# Altium schematic sheet SCH-CAPE-Nucleo_Interface_V1R0.SchDoc: Cajun Advanced Picosatellite Experiment - CAPE-3 - AX5043 Nucleo Interface Board - V1R0
size D; Date: 09/05/2019; CompanyName: Cajun Advanced Picosatellite Experiment; DrawnBy: Nolan Edwards; Organization: Nolan Edwards; Address1: 337 852 0914; Address2: nje@nolanjohnedwards.com; Address3: LA EI.0033436; Address4: Customer:; Revision: 0; SheetNumber: 1; SheetTotal: 1; Version: 1; Draft: DRAFT
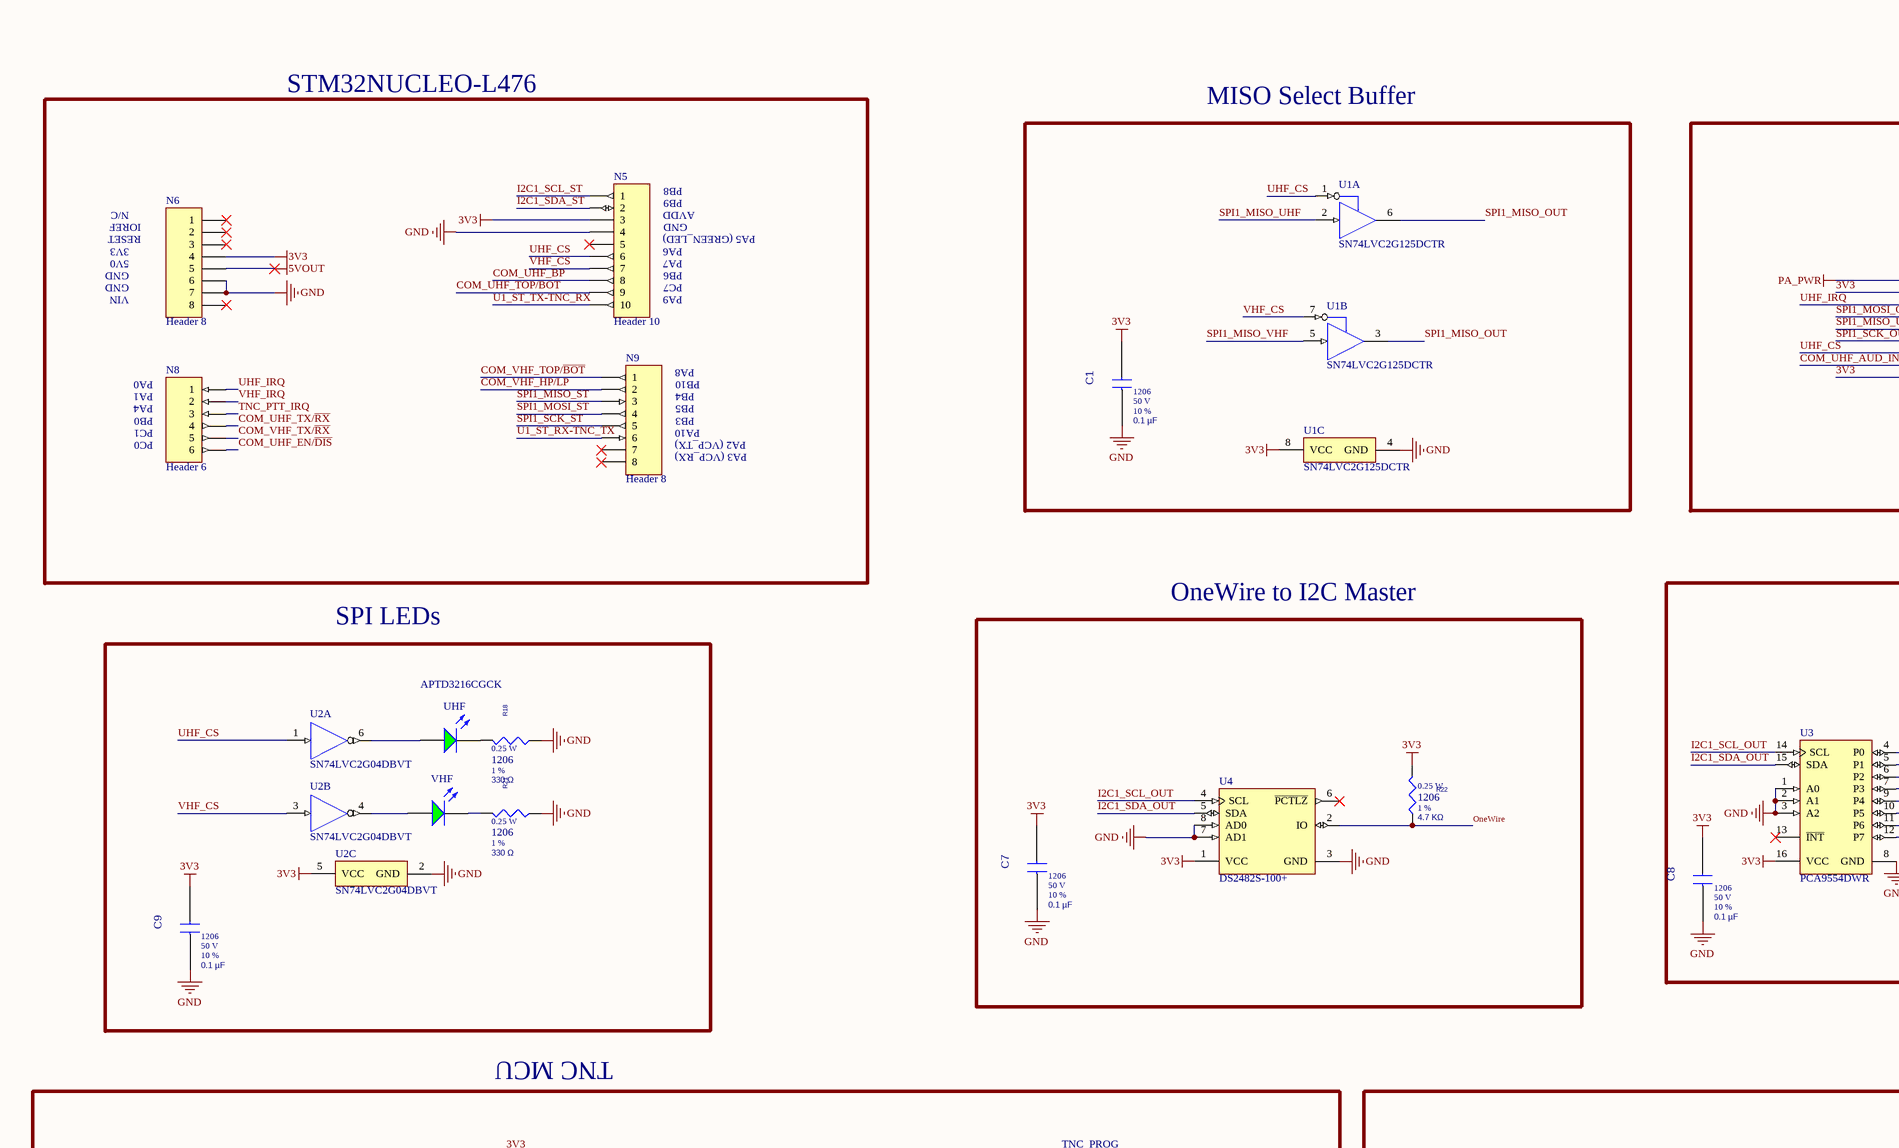
[diagram p0: SCH-CAPE-Nucleo_Interface_V1R0.SchDoc, top left]
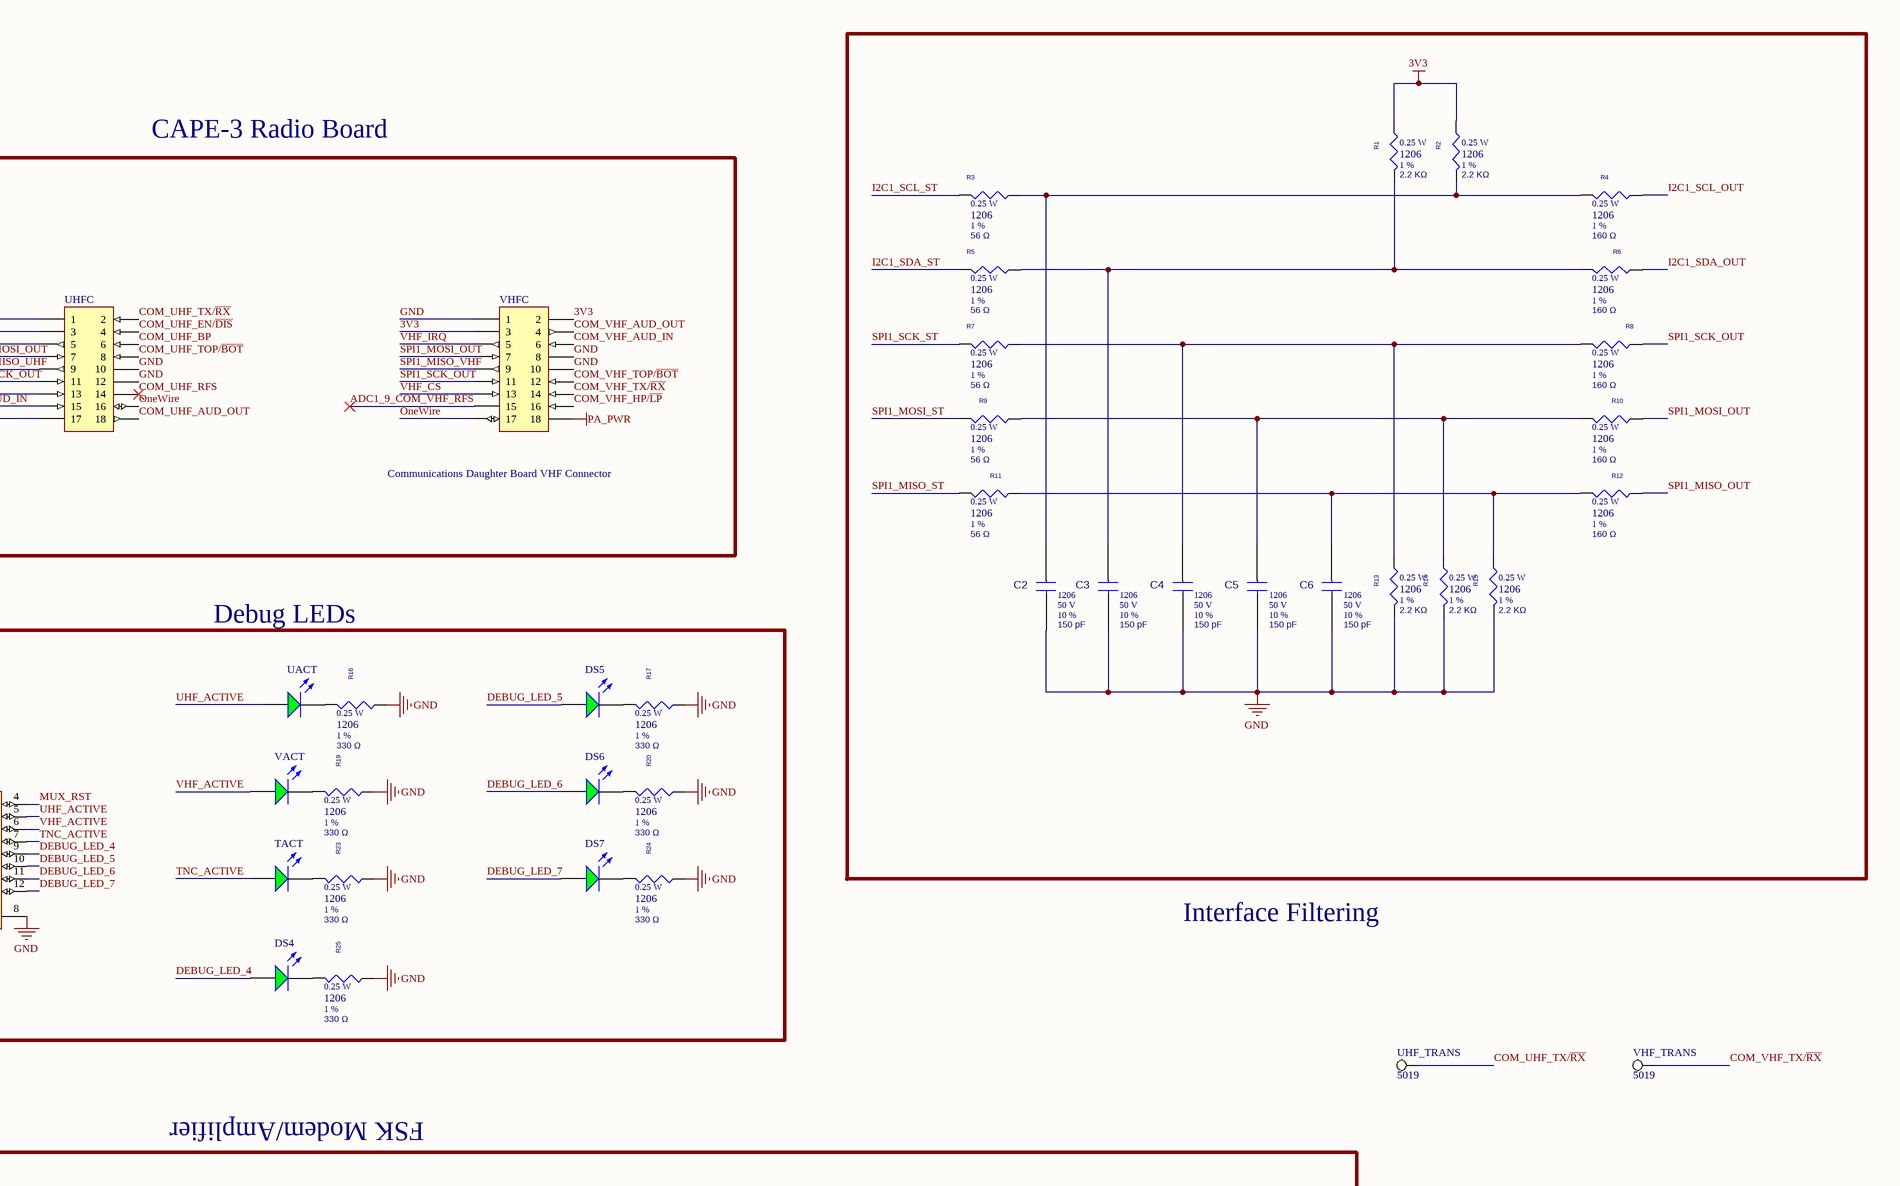
[diagram p1: SCH-CAPE-Nucleo_Interface_V1R0.SchDoc, top right]
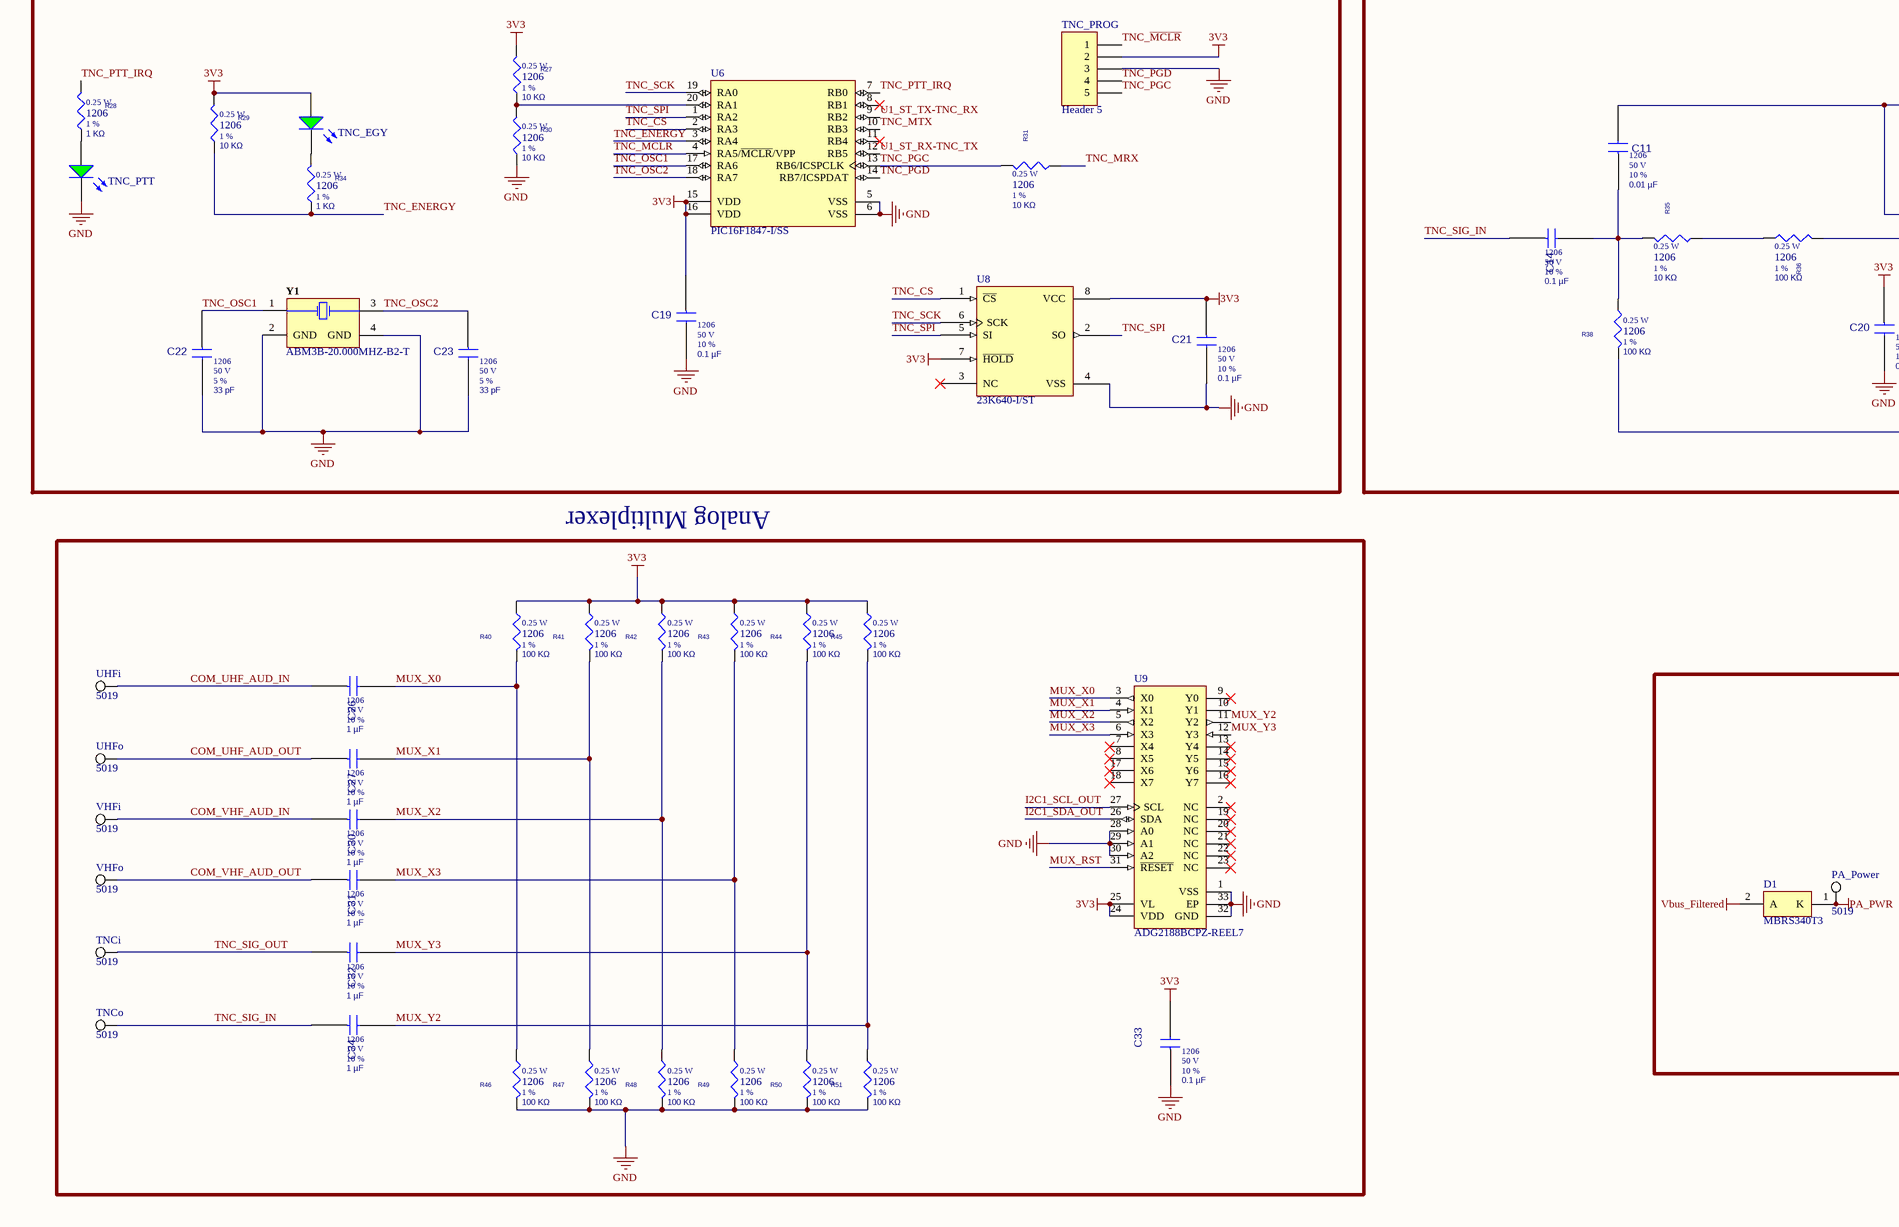
[diagram p2: SCH-CAPE-Nucleo_Interface_V1R0.SchDoc, bottom left]
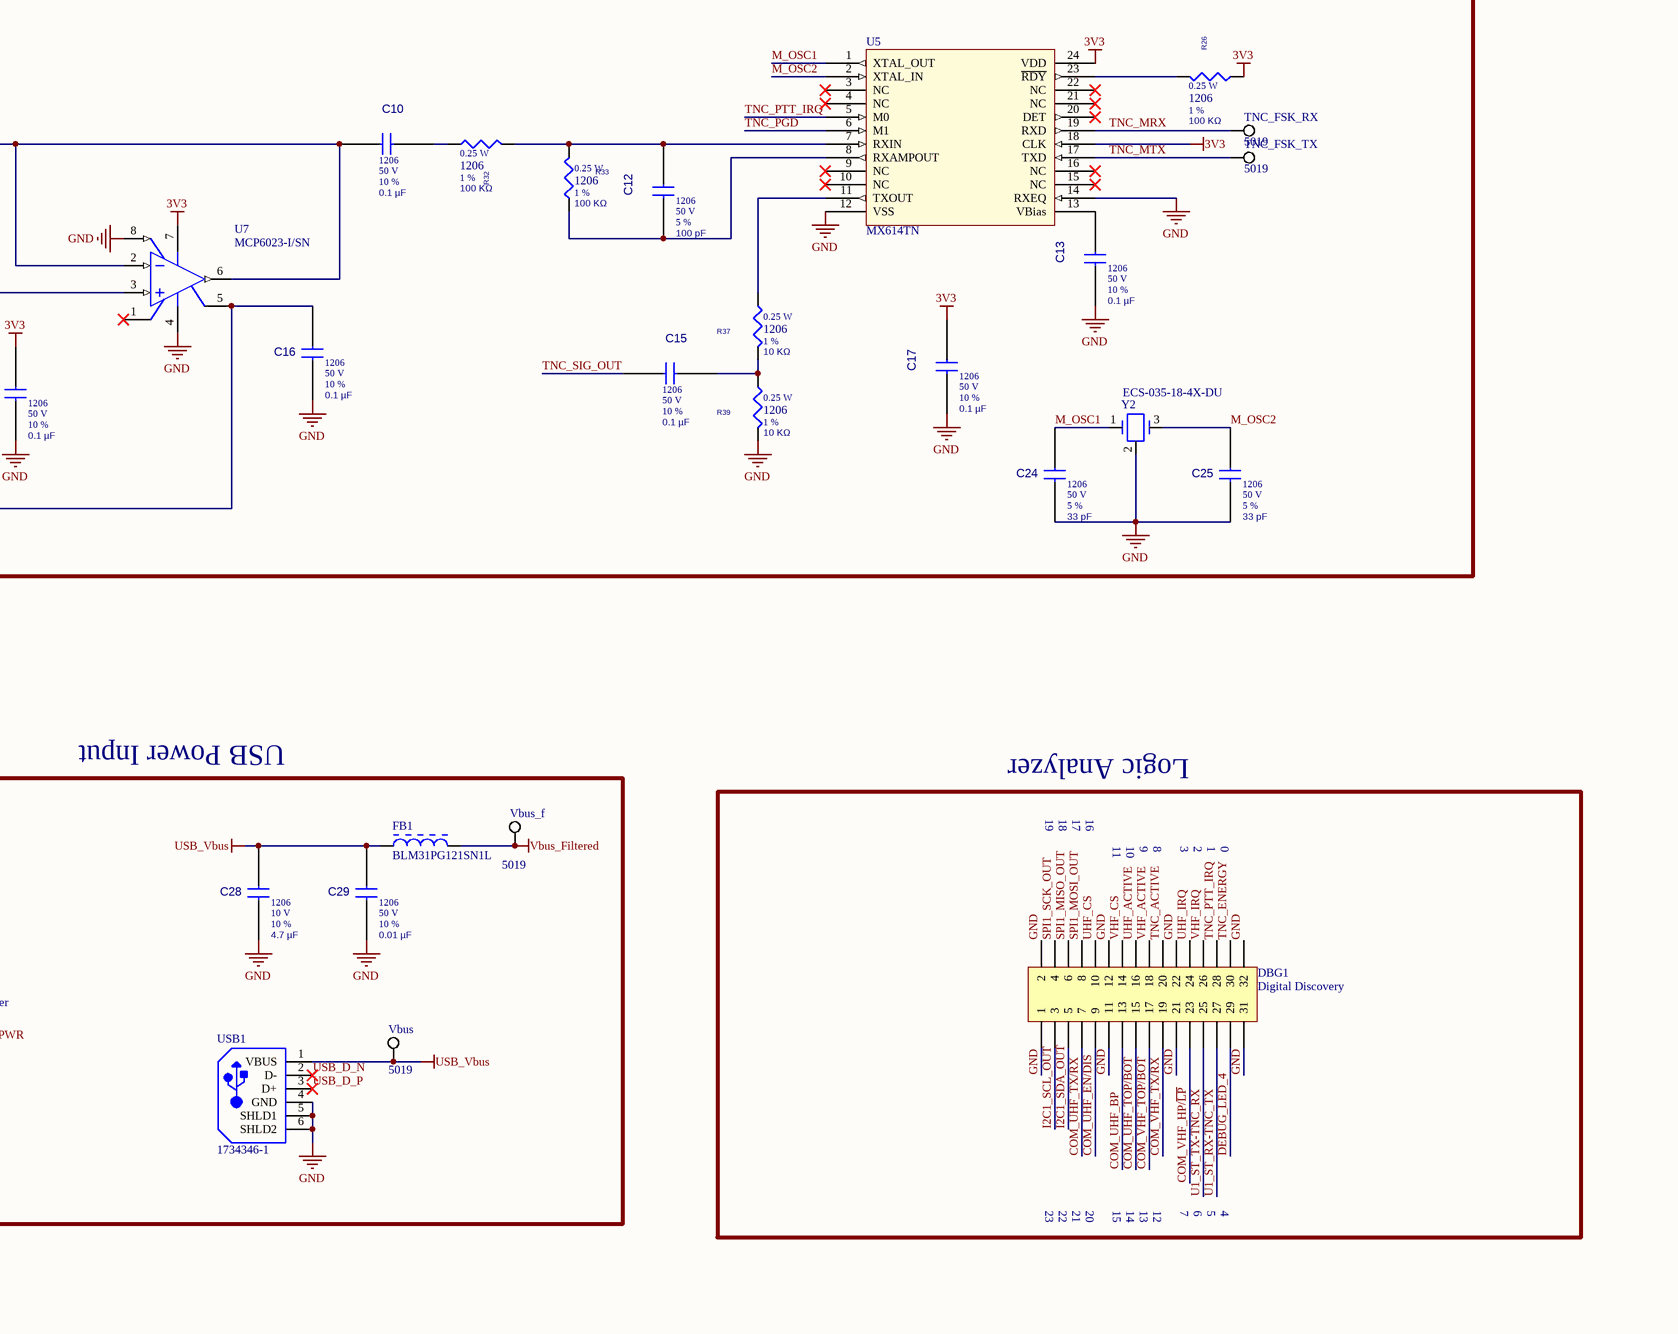
[diagram p3: SCH-CAPE-Nucleo_Interface_V1R0.SchDoc, bottom right]

## Parts
C1  value 0.1 µF  Package: 1206  Voltage Rating: 50 V  Tolerance: 10 %  [1206_GENERIC]  (hidden comment: SMT Capacitor)
C2  value 150 pF  Package: 1206  Voltage Rating: 50 V  Tolerance: 10 %  [1206_GENERIC]  (hidden comment: SMT Capacitor)
C3  value 150 pF  Package: 1206  Voltage Rating: 50 V  Tolerance: 10 %  [1206_GENERIC]  (hidden comment: SMT Capacitor)
C4  value 150 pF  Package: 1206  Voltage Rating: 50 V  Tolerance: 10 %  [1206_GENERIC]  (hidden comment: SMT Capacitor)
C5  value 150 pF  Package: 1206  Voltage Rating: 50 V  Tolerance: 10 %  [1206_GENERIC]  (hidden comment: SMT Capacitor)
C6  value 150 pF  Package: 1206  Voltage Rating: 50 V  Tolerance: 10 %  [1206_GENERIC]  (hidden comment: SMT Capacitor)
C7  value 0.1 µF  Package: 1206  Voltage Rating: 50 V  Tolerance: 10 %  [1206_GENERIC]  (hidden comment: SMT Capacitor)
C8  value 0.1 µF  Package: 1206  Voltage Rating: 50 V  Tolerance: 10 %  [1206_GENERIC]  (hidden comment: SMT Capacitor)
C9  value 0.1 µF  Package: 1206  Voltage Rating: 50 V  Tolerance: 10 %  [1206_GENERIC]  (hidden comment: SMT Capacitor)
C10  value 0.1 µF  Package: 1206  Voltage Rating: 50 V  Tolerance: 10 %  [1206_GENERIC]  (hidden comment: SMT Capacitor)
C11  value 0.01 µF  Package: 1206  Voltage Rating: 50 V  Tolerance: 10 %  [1206_GENERIC]  (hidden comment: SMT Capacitor)
C12  value 100 pF  Package: 1206  Voltage Rating: 50 V  Tolerance: 5 %  [1206_GENERIC]  (hidden comment: SMT Capacitor)
C13  value 0.1 µF  Package: 1206  Voltage Rating: 50 V  Tolerance: 10 %  [1206_GENERIC]  (hidden comment: SMT Capacitor)
C14  value 0.1 µF  Package: 1206  Voltage Rating: 50 V  Tolerance: 10 %  [1206_GENERIC]  (hidden comment: SMT Capacitor)
C15  value 0.1 µF  Package: 1206  Voltage Rating: 50 V  Tolerance: 10 %  [1206_GENERIC]  (hidden comment: SMT Capacitor)
C16  value 0.1 µF  Package: 1206  Voltage Rating: 50 V  Tolerance: 10 %  [1206_GENERIC]  (hidden comment: SMT Capacitor)
C17  value 0.1 µF  Package: 1206  Voltage Rating: 50 V  Tolerance: 10 %  [1206_GENERIC]  (hidden comment: SMT Capacitor)
C19  value 0.1 µF  Package: 1206  Voltage Rating: 50 V  Tolerance: 10 %  [1206_GENERIC]  (hidden comment: SMT Capacitor)
C20  value 0.1 µF  Package: 1206  Voltage Rating: 50 V  Tolerance: 10 %  [1206_GENERIC]  (hidden comment: SMT Capacitor)
C21  value 0.1 µF  Package: 1206  Voltage Rating: 50 V  Tolerance: 10 %  [1206_GENERIC]  (hidden comment: SMT Capacitor)
C22  value 33 pF  Package: 1206  Voltage Rating: 50 V  Tolerance: 5 %  [1206_GENERIC]  (hidden comment: SMT Capacitor)
C23  value 33 pF  Package: 1206  Voltage Rating: 50 V  Tolerance: 5 %  [1206_GENERIC]  (hidden comment: SMT Capacitor)
C24  value 33 pF  Package: 1206  Voltage Rating: 50 V  Tolerance: 5 %  [1206_GENERIC]  (hidden comment: SMT Capacitor)
C25  value 33 pF  Package: 1206  Voltage Rating: 50 V  Tolerance: 5 %  [1206_GENERIC]  (hidden comment: SMT Capacitor)
C26  value 1 µF  Package: 1206  Voltage Rating: 16 V  Tolerance: 10 %  [1206_GENERIC]  (hidden comment: SMT Capacitor)
C27  value 1 µF  Package: 1206  Voltage Rating: 16 V  Tolerance: 10 %  [1206_GENERIC]  (hidden comment: SMT Capacitor)
C28  value 4.7 µF  Package: 1206  Voltage Rating: 10 V  Tolerance: 10 %  [1206_GENERIC]  (hidden comment: SMT Capacitor)
C29  value 0.01 µF  Package: 1206  Voltage Rating: 50 V  Tolerance: 10 %  [1206_GENERIC]  (hidden comment: SMT Capacitor)
C30  value 1 µF  Package: 1206  Voltage Rating: 16 V  Tolerance: 10 %  [1206_GENERIC]  (hidden comment: SMT Capacitor)
C31  value 1 µF  Package: 1206  Voltage Rating: 16 V  Tolerance: 10 %  [1206_GENERIC]  (hidden comment: SMT Capacitor)
C32  value 1 µF  Package: 1206  Voltage Rating: 16 V  Tolerance: 10 %  [1206_GENERIC]  (hidden comment: SMT Capacitor)
C33  value 0.1 µF  Package: 1206  Voltage Rating: 50 V  Tolerance: 10 %  [1206_GENERIC]  (hidden comment: SMT Capacitor)
C34  value 1 µF  Package: 1206  Voltage Rating: 16 V  Tolerance: 10 %  [1206_GENERIC]  (hidden comment: SMT Capacitor)
D1  MBRS340T3  [ONSC-SMC-2-403-03_V]
DBG1  Digital Discovery  [HDR2X16H]
DS4  APTD3216CGCK  [KING-APTD3216CGCK_V]  (value not drawn)
DS5  APTD3216CGCK  [KING-APTD3216CGCK_V]  (value not drawn)
DS6  APTD3216CGCK  [KING-APTD3216CGCK_V]  (value not drawn)
DS7  APTD3216CGCK  [KING-APTD3216CGCK_V]  (value not drawn)
FB1  BLM31PG121SN1L  [MURA-BLM31-B35-CHIP-2_V2]
N5  Header 10  [HDR1X10]  (no BOM)
N6  Header 8  [HDR1X8]  (no BOM)
N8  Header 6  [HDR1X6]  (no BOM)
N9  Header 8  [HDR1X8]  (no BOM)
PA_Power  5019  [KSTN-5019_V]
R1  value 2.2 KΩ  Power Rating: 0.25 W  Package: 1206  Tolerance: 1 %  [1206_GENERIC]  (hidden comment: SMT Resistor)
R2  value 2.2 KΩ  Power Rating: 0.25 W  Package: 1206  Tolerance: 1 %  [1206_GENERIC]  (hidden comment: SMT Resistor)
R3  value 56 Ω  Power Rating: 0.25 W  Package: 1206  Tolerance: 1 %  [1206_GENERIC]  (hidden comment: SMT Resistor)
R4  value 160 Ω  Power Rating: 0.25 W  Package: 1206  Tolerance: 1 %  [1206_GENERIC]  (hidden comment: SMT Resistor)
R5  value 56 Ω  Power Rating: 0.25 W  Package: 1206  Tolerance: 1 %  [1206_GENERIC]  (hidden comment: SMT Resistor)
R6  value 160 Ω  Power Rating: 0.25 W  Package: 1206  Tolerance: 1 %  [1206_GENERIC]  (hidden comment: SMT Resistor)
R7  value 56 Ω  Power Rating: 0.25 W  Package: 1206  Tolerance: 1 %  [1206_GENERIC]  (hidden comment: SMT Resistor)
R8  value 160 Ω  Power Rating: 0.25 W  Package: 1206  Tolerance: 1 %  [1206_GENERIC]  (hidden comment: SMT Resistor)
R9  value 56 Ω  Power Rating: 0.25 W  Package: 1206  Tolerance: 1 %  [1206_GENERIC]  (hidden comment: SMT Resistor)
R10  value 160 Ω  Power Rating: 0.25 W  Package: 1206  Tolerance: 1 %  [1206_GENERIC]  (hidden comment: SMT Resistor)
R11  value 56 Ω  Power Rating: 0.25 W  Package: 1206  Tolerance: 1 %  [1206_GENERIC]  (hidden comment: SMT Resistor)
R12  value 160 Ω  Power Rating: 0.25 W  Package: 1206  Tolerance: 1 %  [1206_GENERIC]  (hidden comment: SMT Resistor)
R13  value 2.2 KΩ  Power Rating: 0.25 W  Package: 1206  Tolerance: 1 %  [1206_GENERIC]  (hidden comment: SMT Resistor)
R14  value 2.2 KΩ  Power Rating: 0.25 W  Package: 1206  Tolerance: 1 %  [1206_GENERIC]  (hidden comment: SMT Resistor)
R15  value 2.2 KΩ  Power Rating: 0.25 W  Package: 1206  Tolerance: 1 %  [1206_GENERIC]  (hidden comment: SMT Resistor)
R16  value 330 Ω  Power Rating: 0.25 W  Package: 1206  Tolerance: 1 %  [1206_GENERIC]  (hidden comment: SMT Resistor)
R17  value 330 Ω  Power Rating: 0.25 W  Package: 1206  Tolerance: 1 %  [1206_GENERIC]  (hidden comment: SMT Resistor)
R18  value 330 Ω  Power Rating: 0.25 W  Package: 1206  Tolerance: 1 %  [1206_GENERIC]  (hidden comment: SMT Resistor)
R19  value 330 Ω  Power Rating: 0.25 W  Package: 1206  Tolerance: 1 %  [1206_GENERIC]  (hidden comment: SMT Resistor)
R20  value 330 Ω  Power Rating: 0.25 W  Package: 1206  Tolerance: 1 %  [1206_GENERIC]  (hidden comment: SMT Resistor)
R21  value 330 Ω  Power Rating: 0.25 W  Package: 1206  Tolerance: 1 %  [1206_GENERIC]  (hidden comment: SMT Resistor)
R22  value 4.7 KΩ  Power Rating: 0.25 W  Package: 1206  Tolerance: 1 %  [1206_GENERIC]  (hidden comment: SMT Resistor)
R23  value 330 Ω  Power Rating: 0.25 W  Package: 1206  Tolerance: 1 %  [1206_GENERIC]  (hidden comment: SMT Resistor)
R24  value 330 Ω  Power Rating: 0.25 W  Package: 1206  Tolerance: 1 %  [1206_GENERIC]  (hidden comment: SMT Resistor)
R25  value 330 Ω  Power Rating: 0.25 W  Package: 1206  Tolerance: 1 %  [1206_GENERIC]  (hidden comment: SMT Resistor)
R26  value 100 KΩ  Power Rating: 0.25 W  Package: 1206  Tolerance: 1 %  [1206_GENERIC]  (hidden comment: SMT Resistor)
R27  value 10 KΩ  Power Rating: 0.25 W  Package: 1206  Tolerance: 1 %  [1206_GENERIC]  (hidden comment: SMT Resistor)
R28  value 1 KΩ  Power Rating: 0.25 W  Package: 1206  Tolerance: 1 %  [1206_GENERIC]  (hidden comment: SMT Resistor)
R29  value 10 KΩ  Power Rating: 0.25 W  Package: 1206  Tolerance: 1 %  [1206_GENERIC]  (hidden comment: SMT Resistor)
R30  value 10 KΩ  Power Rating: 0.25 W  Package: 1206  Tolerance: 1 %  [1206_GENERIC]  (hidden comment: SMT Resistor)
R31  value 10 KΩ  Power Rating: 0.25 W  Package: 1206  Tolerance: 1 %  [1206_GENERIC]  (hidden comment: SMT Resistor)
R32  value 100 KΩ  Power Rating: 0.25 W  Package: 1206  Tolerance: 1 %  [1206_GENERIC]  (hidden comment: SMT Resistor)
R33  value 100 KΩ  Power Rating: 0.25 W  Package: 1206  Tolerance: 1 %  [1206_GENERIC]  (hidden comment: SMT Resistor)
R34  value 1 KΩ  Power Rating: 0.25 W  Package: 1206  Tolerance: 1 %  [1206_GENERIC]  (hidden comment: SMT Resistor)
R35  value 10 KΩ  Power Rating: 0.25 W  Package: 1206  Tolerance: 1 %  [1206_GENERIC]  (hidden comment: SMT Resistor)
R36  value 100 KΩ  Power Rating: 0.25 W  Package: 1206  Tolerance: 1 %  [1206_GENERIC]  (hidden comment: SMT Resistor)
R37  value 10 KΩ  Power Rating: 0.25 W  Package: 1206  Tolerance: 1 %  [1206_GENERIC]  (hidden comment: SMT Resistor)
R38  value 100 KΩ  Power Rating: 0.25 W  Package: 1206  Tolerance: 1 %  [1206_GENERIC]  (hidden comment: SMT Resistor)
R39  value 10 KΩ  Power Rating: 0.25 W  Package: 1206  Tolerance: 1 %  [1206_GENERIC]  (hidden comment: SMT Resistor)
R40  value 100 KΩ  Power Rating: 0.25 W  Package: 1206  Tolerance: 1 %  [1206_GENERIC]  (hidden comment: SMT Resistor)
R41  value 100 KΩ  Power Rating: 0.25 W  Package: 1206  Tolerance: 1 %  [1206_GENERIC]  (hidden comment: SMT Resistor)
R42  value 100 KΩ  Power Rating: 0.25 W  Package: 1206  Tolerance: 1 %  [1206_GENERIC]  (hidden comment: SMT Resistor)
R43  value 100 KΩ  Power Rating: 0.25 W  Package: 1206  Tolerance: 1 %  [1206_GENERIC]  (hidden comment: SMT Resistor)
R44  value 100 KΩ  Power Rating: 0.25 W  Package: 1206  Tolerance: 1 %  [1206_GENERIC]  (hidden comment: SMT Resistor)
R45  value 100 KΩ  Power Rating: 0.25 W  Package: 1206  Tolerance: 1 %  [1206_GENERIC]  (hidden comment: SMT Resistor)
R46  value 100 KΩ  Power Rating: 0.25 W  Package: 1206  Tolerance: 1 %  [1206_GENERIC]  (hidden comment: SMT Resistor)
R47  value 100 KΩ  Power Rating: 0.25 W  Package: 1206  Tolerance: 1 %  [1206_GENERIC]  (hidden comment: SMT Resistor)
R48  value 100 KΩ  Power Rating: 0.25 W  Package: 1206  Tolerance: 1 %  [1206_GENERIC]  (hidden comment: SMT Resistor)
R49  value 100 KΩ  Power Rating: 0.25 W  Package: 1206  Tolerance: 1 %  [1206_GENERIC]  (hidden comment: SMT Resistor)
R50  value 100 KΩ  Power Rating: 0.25 W  Package: 1206  Tolerance: 1 %  [1206_GENERIC]  (hidden comment: SMT Resistor)
R51  value 100 KΩ  Power Rating: 0.25 W  Package: 1206  Tolerance: 1 %  [1206_GENERIC]  (hidden comment: SMT Resistor)
TACT  APTD3216CGCK  [KING-APTD3216CGCK_V]  (value not drawn)
TNC_EGY  APTD3216CGCK  [KING-APTD3216CGCK_V]  (value not drawn)
TNC_FSK_RX  5019  [KSTN-5019_V]
TNC_FSK_TX  5019  [KSTN-5019_V]
TNC_PROG  Header 5  [HDR1X5]  (no BOM)
TNC_PTT  APTD3216CGCK  [KING-APTD3216CGCK_V]  (value not drawn)
TNCi  5019  [KSTN-5019_V]
TNCo  5019  [KSTN-5019_V]
U1  SN74LVC2G125DCTR  [DCT0008A_M]  (parts A,B,C of 3)
U2  SN74LVC2G04DBVT  [DBV0006A_M]  (parts A,B,C of 3)
U3  PCA9554DWR  [DW0016A_M]
U4  DS2482S-100+  [MAXM-SO-8_V]
U5  MX614TN  [24SSOP150_M]
U6  PIC16F1847-I/SS  [MCHP-SSOP-SS20_M]
U7  MCP6023-I/SN  [SOIC-SN8_L]
U8  23K640-I/ST  [TSSOP-ST8_M]
U9  ADG2188BCPZ-REEL7  [ADI-CP-32-2_M]
UACT  APTD3216CGCK  [KING-APTD3216CGCK_V]  (value not drawn)
UHF  APTD3216CGCK  [KING-APTD3216CGCK_V]
UHF_TRANS  5019  [KSTN-5019_V]
UHFC  (no value)  [Molex 87758-1816]
UHFi  5019  [KSTN-5019_V]
UHFo  5019  [KSTN-5019_V]
USB1  1734346-1  [TECO-1734346-1_V]
VACT  APTD3216CGCK  [KING-APTD3216CGCK_V]  (value not drawn)
Vbus  5019  [KSTN-5019_V]
Vbus_f  5019  [KSTN-5019_V]
VHF  APTD3216CGCK  [KING-APTD3216CGCK_V]  (value not drawn)
VHF_TRANS  5019  [KSTN-5019_V]
VHFC  (no value)  [Molex 87758-1816]
VHFi  5019  [KSTN-5019_V]
VHFo  5019  [KSTN-5019_V]
Y1  ABM3B-20.000MHZ-B2-T  [ABRA-ABM3B_V]
Y2  ECS-035-18-4X-DU  [ECS-4X-3IL]

## Blocks framed on the sheet
STM32NUCLEO-L476: N5 N6 N8 N9
MISO Select Buffer: C1 U1
CAPE-3 Radio Board: UHFC VHFC
Debug LEDs: C8 DS4-DS7 R16 R17 R19 R20 R23-R25 TACT U3 UACT VACT
SPI LEDs: C9 R18 R21 U2 UHF VHF
OneWire to I2C Master: C7 R22 U4

## Nets
3V3: C1.1 C7.1 C8.1 C9.1 C17.1 C19.2 C20.2 C21.2 C33.1 N5.3 N6.4 R1.2 R2.2 R22.1 R26.2 R27.1 R29.1 R40.2 R41.2 R42.2 R43.2 R44.2 R45.2 TNC_EGY.1(A) TNC_PROG.2 U1.8(VCC) U2.5(VCC) U3.16(VCC) U4.1(VCC) U5.18(CLK) U5.24(VDD) U6.15(VDD) U6.16(VDD) U7.7(VDD) U8.7(~{HOLD}) U8.8(VCC) U9.24(VDD) U9.25(VL) UHFC.3 UHFC.17 VHFC.2 VHFC.3
5VOUT: N6.5
GND: C1.2 C2.1 C3.1 C4.1 C5.1 C6.1 C7.2 C8.2 C9.2 C13.2 C16.1 C17.2 C19.1 C20.1 C21.1 C22.1 C23.1 C24.1 C25.1 C28.1 C29.1 C33.2 DBG1.1 DBG1.2 DBG1.11 DBG1.12 DBG1.21 DBG1.22 DBG1.31 DBG1.32 N5.4 N6.6 N6.7 R13.1 R14.1 R15.1 R16.2 R17.2 R18.2 R19.2 R20.2 R21.2 R23.2 R24.2 R25.2 R30.2 R39.1 R46.1 R47.1 R48.1 R49.1 R50.1 R51.1 TNC_PROG.3 TNC_PTT.2(K) U1.4(GND) U2.2(GND) U3.1(A0) U3.2(A1) U3.3(A2) U3.8(GND) U4.3(GND) U4.7(AD1) U4.8(AD0) U5.12(VSS) U5.14(RXEQ) U6.5(VSS) U6.6(VSS) U7.4(VSS) U7.8(~{CS}) U8.4(VSS) U9.1(VSS) U9.28(A0) U9.29(A1) U9.30(A2) U9.32(GND) U9.33(EP) UHFC.10 UHFC.12 USB1.4(GND) USB1.5(SHLD1) USB1.6(SHLD2) VHFC.1 VHFC.8 VHFC.10 Y1.2(GND) Y1.4(GND) Y2.2
PA_PWR: D1.1(K) PA_Power.1 UHFC.1 VHFC.18
USB_Vbus: C28.2 C29.2 FB1.1 USB1.1(VBUS) Vbus.1
Vbus_Filtered: D1.2(A) FB1.2 Vbus_f.1
ADC1_9_COM_VHF_RFS: VHFC.15
COM_UHF_AUD_IN: C26.2 UHFC.15 UHFi.1
COM_UHF_AUD_OUT: C27.2 UHFC.18 UHFo.1
COM_UHF_BP: DBG1.13 N5.8 UHFC.6
COM_UHF_EN/~{DIS}: DBG1.9 N8.6 UHFC.4
COM_UHF_RFS: UHFC.14
COM_UHF_TOP/~{BOT}: DBG1.15 N5.9 UHFC.8
COM_UHF_TX/~{RX}: DBG1.7 N8.4 UHF_TRANS.1 UHFC.2
COM_VHF_AUD_IN: C30.2 VHFC.6 VHFi.1
COM_VHF_AUD_OUT: C31.2 VHFC.4 VHFo.1
COM_VHF_HP/~{LP}: DBG1.23 N9.2 VHFC.16
COM_VHF_TOP/~{BOT}: DBG1.17 N9.1 VHFC.12
COM_VHF_TX/~{RX}: DBG1.19 N8.5 VHF_TRANS.1 VHFC.14
DEBUG_LED_4: DBG1.29 DS4.1(A) U3.9(P4)
DEBUG_LED_5: DS5.1(A) U3.10(P5)
DEBUG_LED_6: DS6.1(A) U3.11(P6)
DEBUG_LED_7: DS7.1(A) U3.12(P7)
I2C1_SCL_OUT: DBG1.3 R4.2 U3.14(SCL) U4.4(SCL) U9.27(SCL)
I2C1_SCL_ST: N5.1 R3.1
I2C1_SDA_OUT: DBG1.5 R6.2 U3.15(SDA) U4.5(SDA) U9.26(SDA)
I2C1_SDA_ST: N5.2 R5.1
M_OSC1: C24.2 U5.1(XTAL_OUT) Y2.1
M_OSC2: C25.2 U5.2(XTAL_IN) Y2.3
MUX_RST: U3.4(P0) U9.31(~{RESET})
MUX_X0: C26.1 R40.1 R46.2 U9.3(X0)
MUX_X1: C27.1 R41.1 R47.2 U9.4(X1)
MUX_X2: C30.1 R42.1 R48.2 U9.5(X2)
MUX_X3: C31.1 R43.1 R49.2 U9.6(X3)
MUX_Y2: C34.1 R45.1 R51.2 U9.11(Y2)
MUX_Y3: C32.1 R44.1 R50.2 U9.12(Y3)
OneWire: R22.2 U4.2(IO) UHFC.16 VHFC.17
SPI1_MISO_OUT: DBG1.6 R12.2 U1.3(2Y) U1.6(1Y)
SPI1_MISO_ST: N9.3 R11.1
SPI1_MISO_UHF: U1.2(1A) UHFC.9
SPI1_MISO_VHF: U1.5(2A) VHFC.9
SPI1_MOSI_OUT: DBG1.8 R10.2 UHFC.7 VHFC.7
SPI1_MOSI_ST: N9.4 R9.1
SPI1_SCK_OUT: DBG1.4 R8.2 UHFC.11 VHFC.11
SPI1_SCK_ST: N9.5 R7.1
TNC_ACTIVE: DBG1.20 TACT.1(A) U3.7(P3)
TNC_CS: U6.2(RA3) U8.1(~{CS})
TNC_ENERGY: DBG1.30 R29.2 R34.2 U6.3(RA4)
TNC_~{MCLR}: TNC_PROG.1 U6.4(RA5/~{MCLR}/VPP)
TNC_MRX: R31.2 TNC_FSK_RX.1 U5.19(RXD)
TNC_MTX: TNC_FSK_TX.1 U5.17(TXD) U6.10(RB3)
TNC_OSC1: C22.2 U6.17(RA6) Y1.1(X1)
TNC_OSC2: C23.2 U6.18(RA7) Y1.3(X2)
TNC_PGC: R31.1 TNC_PROG.5 U6.13(RB6/ICSPCLK)
TNC_PGD: TNC_PROG.4 U5.6(M1) U6.14(RB7/ICSPDAT)
TNC_PTT_IRQ: DBG1.28 N8.3 R28.1 U5.5(M0) U6.7(RB0)
TNC_SCK: U6.19(RA0) U8.6(SCK)
TNC_SIG_IN: C14.2 C34.2 TNCo.1
TNC_SIG_OUT: C15.2 C32.2 TNCi.1
TNC_SPI: U6.1(RA2) U8.2(SO) U8.5(SI)
U1_ST_RX-TNC_TX: DBG1.27 N9.6 U6.12(RB5)
U1_ST_TX-TNC_RX: DBG1.25 N5.10 U6.9(RB2)
UHF_ACTIVE: DBG1.16 U3.5(P1) UACT.1(A)
UHF_CS: DBG1.10 N5.6 U1.1(1~{OE}) U2.1(1A) UHFC.13
UHF_IRQ: DBG1.24 N8.1 UHFC.5
USB_D_N: USB1.2(D-)
USB_D_P: USB1.3(D+)
VHF_ACTIVE: DBG1.18 U3.6(P2) VACT.1(A)
VHF_CS: DBG1.14 N5.7 U1.7(2~{OE}) U2.3(2A) VHFC.13
VHF_IRQ: DBG1.26 N8.2 VHFC.5
NetC2_2: C2.2 R2.1 R3.2 R4.1
NetC3_2: C3.2 R1.1 R5.2 R6.1
NetC4_2: C4.2 R7.2 R8.1 R13.2
NetC5_2: C5.2 R9.2 R10.1 R14.2
NetC6_2: C6.2 R11.2 R12.1 R15.2
NetC10_1: C10.1 R32.2
NetC10_2: C10.2 C11.1 U7.2(VIN-) U7.6(VOUT)
NetC11_2: C11.2 C14.1 R35.1 R38.2
NetC12_1: C12.1 R32.1 R33.1 U5.7(RXIN)
NetC12_2: C12.2 R33.2 U5.8(RXAMPOUT)
NetC13_1: C13.1 U5.13(VBias)
NetC15_1: C15.1 R37.1 R39.2
NetC16_2: C16.2 R38.1 U7.5(VREF)
NetDS4_2: DS4.2(K) R25.1
NetDS5_2: DS5.2(K) R17.1
NetDS6_2: DS6.2(K) R20.1
NetDS7_2: DS7.2(K) R24.1
NetR16_1: R16.1 UACT.2(K)
NetR18_1: R18.1 UHF.2(K)
NetR19_1: R19.1 VACT.2(K)
NetR21_1: R21.1 VHF.2(K)
NetR23_1: R23.1 TACT.2(K)
NetR26_1: R26.1 U5.23(~{RDY})
NetR27_2: R27.2 R30.1 U6.20(RA1)
NetR28_2: R28.2 TNC_PTT.1(A)
NetR34_1: R34.1 TNC_EGY.2(K)
NetR35_2: R35.2 R36.2
NetR36_1: R36.1 U7.3(VIN+)
NetR37_2: R37.2 U5.11(TXOUT)
NetU2_4: U2.4(2Y) VHF.1(A)
NetU2_6: U2.6(1Y) UHF.1(A)

Not connected (* = marked no-connect by the designer): N5 5*; N6 1* 2* 3* 8*; N9 7* 8*; U3 13(~{INT})*; U4 6(~{PCTLZ})*; U5 3(NC)* 4(NC)* 9(NC)* 10(NC)* 15(NC)* 16(NC)* 20(DET)* 21(NC)* 22(NC)*; U6 8(RB1)* 11(RB4)*; U7 1(NC)*; U8 3(NC)*; U9 2(NC)* 7(X4)* 8(X5)* 9(Y0)* 10(Y1) 13(Y4)* 14(Y5)* 15(Y6)* 16(Y7)* 17(X6)* 18(X7)* 19(NC)* 20(NC)* 21(NC)* 22(NC)* 23(NC)*

## Notes on the sheet
- N/C
- PB8
- PB9
- AVDD
- 3V3
- 5V0
- GND
- IOREF
- RESET
- PA5 (GREEN_LED)
- PA6
- PA7
- PB6
- VIN
- PC7
- PA9
- PA0
- PA1
- PA8
- PB10
- PB4
- PA4
- PB0
- PC1
- PC0
- PB5
- PB3
- PA10
- PA2 (VCP_TX)
- PA3 (VCP_RX)
- Communications Daughter Board VHF Connector
- Interface Filtering
- TNC MCU
- FSK Modem/Amplifier
- Analog Multiplexer
- USB Power Input
- Logic Analyzer
- 19
- 18
- 17
- 16
- 11
- 10
- 9
- 8
- 3
- 2
- 1
- 0
- 23
- 22
- 21
- 20
- 15
- 14
- 13
- 12
- 7
- 6
- 5
- 4
- Title:
- Number:
- Size:
- Sheet
- D
- Version:
- of
- Revision:
- Drawn:
- Approved:
- Date:
- THIS DOCUMENT IS NOT CONTROLLED IF PRINTED

## Library data of the parts
C1 C7-C10 C13-C17 C19-C21 C33 = SMT Capacitor: Ceramic Capacitor, =Value, =Tolerance, =VoltageRating, =Package; Part Number: CL31B104KBCNNNC; Manufacturer: Samsung
C2-C6 = SMT Capacitor: Ceramic Capacitor, =Value, =Tolerance, =VoltageRating, =Package; Part Number: 885012208101; Manufacturer: Wurth Electronics Inc.
C11 C29 = SMT Capacitor: Ceramic Capacitor, =Value, =Tolerance, =VoltageRating, =Package; Part Number: CL31B103KBCNNNC; Manufacturer: Samsung
C12 = SMT Capacitor: Ceramic Capacitor, =Value, =Tolerance, =VoltageRating, =Package; Part Number: CL31C101JBCNNNC; Manufacturer: Samsung
C22-C25 = SMT Capacitor: Ceramic Capacitor, =Value, =Tolerance, =VoltageRating, =Package; Part Number: CL31C330JBCNNNC; Manufacturer: Samsung
C26 C27 C30-C32 C34 = SMT Capacitor: Ceramic Capacitor, =Value, =Tolerance, =VoltageRating, =Package; Part Number: CL31B105KOFNNNE; Manufacturer: Samsung
C28 = SMT Capacitor: Ceramic Capacitor, =Value, =Tolerance, =VoltageRating, =Package; Part Number: CL31A475KPHNNNE; Manufacturer: Samsung
D1 = CMP-1055-00395-1: Schottky Power Rectifier, 2-Pin SMC, Tape and Reel; Manufacturer: On Semiconductor; Configuration: Single; IFSM Max (A): 80; DatasheetVersion: Rev. 11; ComponentLink2URL: http://www.onsemi.cn/pub_link/Collateral/MBRS340T3-D.PDF; Part Number: MBRS340T3; ComponentLink2Description: Datasheet; Packing: Tape and Reel; RoHS: FALSE; PackageDescription: 2-Pin Small Molded Package, J-Bend Lead, Body 5.845 x 6.855 mm; ComponentLink1URL: http://www.onsemi.com/; ComponentLink1Description: Manufacturer URL; PackageVersion: Rev. E, 08/2005; ComponentLink3Description: Package Specification; PackageReference: SMC-2-403-03; ComponentLink3URL: http://www.onsemi.com/pub_link/Collateral/403-03.PDF; Mounting Technology: Surface Mount
DBG1 = Header 16X2H: Header, 16-Pin, Dual row, Right Angle; Part Number: SSQ-116-02-T-D-RA; Manufacturer: Samtec; LatestRevisionDate: 17-Jul-2002; LatestRevisionNote: Re-released for DXP Platform.; Publisher: Altium Limited
DS4-DS7 TACT TNC_EGY TNC_PTT UACT UHF VACT VHF = CMP-2000-05792-1: Chip LED Lamp, Green, 5 V, 30 mA, -40 to 85 degC, 2-Pin SMD, RoHS, Tape and Reel; Manufacturer: Kingbright; Wavelength - Dominant: 570nm; Online Catalog: 3.2mmx1.6mmRoundwithDomedTop1206PackageLEDs; Viewing Angle: 50°; Voltage - Forward (Vf) (Typ): 2.1V; Lens Type: Clear; Wavelength - Peak: 574nm; Other Names: 754-1152-2; 3D Model: APTD3216x.sldprt / APTD3216x.pro / APTD3216x.igs / APTD3216x.stp; Catalog Drawings: APTD3216SeriesTop / APTD3216SeriesSide; Current - Test: 20mA; Millicandela Rating: 300mcd; Lens Style/Size: RoundwithDomedTop,1.6mm; Standard Package: 2,000; Datasheet URL: https://www.kingbrightusa.com/images/catalog/spec/APTD3216CGCK.pdf; Family: LEDIndication-Discrete; Category: Optoelectronics; Package Reference: APTD3216CGCK; Datasheet Version: Rev. V.17B, 04/2015; Package / Case: 1206(3216Metric); Mounting Technology: SurfaceMount; Color: Green; Packaging: Tape&Reel(TR); Manufacturer URL: http://www.kingbright.com/; Height: 1.80mm; Package Description: 2-Pin Surface Mount Device, Body 3.2 x 1.6 mm; Mounting Type: SurfaceMount; Size / Dimension: 3.20mmLx1.60mmW; Part Number: APTD3216CGCK
FB1 = CMP-0686-00732-2: Chip Ferrite Bead for Power Lines, 120 Ohm, 3500 mA, -55 to 125 degC, 3.2 x 1.6 x 1.3 mm SMD, Tape and Reel; Manufacturer: Murata; DC Resistance: 0.02 Ohm Max.; Impedance (at 100 MHz): 120 Ohm +/- 25%; Rated Current: 3500 mA; ComponentLink1Description: Manufacturer URL; ComponentLink3Description: Package Specification; Mounting Technology: Surface Mount; ComponentLink1URL: http://www.murata.com/; ComponentLink2URL: http://www.murata.com/products/catalog/pdf/c31e.pdf; Part Number: BLM31PG121SN1L; DatasheetVersion: 08/2013; PackageReference: BLM31-2; ComponentLink2Description: Datasheet; PackageDescription: 2-Pin Chip, Body 3.2 x 1.6 mm; Packing: Tape and Reel; ComponentLink3URL: http://www.murata.com/products/catalog/pdf/c31e.pdf; Operating Temperature Range: -55 to 125 degC
N5 = Header 10: Header, 10-Pin; LatestRevisionDate: 17-Jul-2002; LatestRevisionNote: Re-released for DXP Platform.; Publisher: Altium Limited
N6 N9 = Header 8: Header, 8-Pin; LatestRevisionDate: 17-Jul-2002; LatestRevisionNote: Re-released for DXP Platform.; Publisher: Altium Limited
N8 = Header 6: Header, 6-Pin; LatestRevisionDate: 17-Jul-2002; LatestRevisionNote: Re-released for DXP Platform.; Publisher: Altium Limited
PA_Power TNC_FSK_RX TNC_FSK_TX TNCi TNCo UHF_TRANS UHFi UHFo Vbus Vbus_f VHF_TRANS VHFi VHFo = CMP-1672-00008-1: Test Point, 1 Position SMD, RoHS, Tape and Reel; Manufacturer: Keystone Electronics; ComponentLink1Description: Manufacturer URL; Package Quantity: 1000; DatasheetVersion: 03/2014; Packaging: Tape and Reel; ComponentLink2URL: http://www.keyelco.com/product-pdf.cfm?p=1357; ComponentLink1URL: http://www.keyelco.com/; Mount: Surface Mount; Contact Plating: 9; PackageDescription: 1-Pin Surface Mount Device, Body 3.81 x 2.03 mm; Pins: 1; RoHSCompliant: True; Mounting Technology: Surface Mount; ComponentLink2Description: Datasheet; PackageReference: 5019; Part Number: 5019
R1 R2 R13-R15 = SMT Resistor: Generic SMT Resistor; Part Number: RC1206FR-072K2L; Manufacturer: Yageo
R3 R5 R7 R9 R11 = SMT Resistor: Generic SMT Resistor; Part Number: RC1206FR-0756RL; Manufacturer: Yageo
R4 R6 R8 R10 R12 = SMT Resistor: Generic SMT Resistor; Part Number: RC1206FR-07160RL; Manufacturer: Yageo
R16-R21 R23-R25 = SMT Resistor: Generic SMT Resistor; Part Number: RC1206FR-07330RL; Manufacturer: Yageo
R22 = SMT Resistor: Generic SMT Resistor; Part Number: RC1206FR-074K7L; Manufacturer: Yageo
R26 R32 R33 R36 R38 R40-R51 = SMT Resistor: Generic SMT Resistor; Part Number: RC1206FR-07100KL; Manufacturer: Yageo
R27 R29-R31 R35 R37 R39 = SMT Resistor: Generic SMT Resistor; Part Number: RC1206FR-0710KL; Manufacturer: Yageo
R28 R34 = SMT Resistor: Generic SMT Resistor; Part Number: RC1206FR-071KL; Manufacturer: Yageo
TNC_PROG = Header 5: Header, 5-Pin; LatestRevisionDate: 17-Jul-2002; LatestRevisionNote: Re-released for DXP Platform.; Publisher: Altium Limited
U1 = CMP-0859-00540-3: Dual Bus Buffer Gate with 3-State Outputs, DCT0008A, LARGE T&R; Manufacturer: Texas Instruments; VCC(Min)(V): 1.65; Voltage(Nom)(V): 1.8,2.5,3.3,5; Output Drive (IOL/IOH)(Max)(mA): 32/-32; Logic: True; tpd @ Nom Voltage(Max)(ns): 9.1,4.8,4.3,3.7; F @ Nom Voltage(Max)(Mhz): 150; Bits(#): 2; Sub-Family: Non-Inverting Buffer/Driver; Output Type: CMOS; 3-State Output: Yes; Input Type: CMOS/TTL; Technology Family: LVC; VCC(Max)(V): 5.5; Schmitt Trigger: No; ICC @ Nom Voltage(Max)(mA): 0.01; Rating: Catalog; Operating Temperature Range(C): -40 to 125; PackageReference: DCT0008A; DatasheetVersion: SCES204O; Generic Part Number: SN74LVC2G125; PartId: 1; Part Number: SN74LVC2G125DCTR
U2 = CMP-0859-00210-3: Dual Inverter, DBV0006A, SMALL T&R; Manufacturer: Texas Instruments; Voltage(Nom)(V): 1.8,2.5,3.3,5; tpd @ Nom Voltage(Max)(ns): 8,4.9,4.6,3.7; ICC @ Nom Voltage(Max)(mA): 0.01; Logic: Inverting; Output Drive (IOL/IOH)(Max)(mA): 32/-32; VCC(Max)(V): 5.5; VCC(Min)(V): 1.65; Bits(#): 2; Technology Family: LVC; Rating: Catalog; 3-State Output: No; Output Type: CMOS; Sub-Family: Inverting Buffer/Driver; Input Type: CMOS/TTL; F @ Nom Voltage(Max)(Mhz): 150; Generic Part Number: SN74LVC2G04; DatasheetVersion: SCES195M; Schmitt Trigger: No; PackageReference: DBV0006A; Operating Temperature Range(C): -40 to 125; PartId: 1; Part Number: SN74LVC2G04DBVT
U3 = CMP-0314-00167-2: Remote 8-Bit I2C and SMBus I/O Expander with Interrupt Output and Configuration Registers, 8 Outputs, 2.3 to 5.5 V, -40 to 85 degC, 16-pin SOIC (DW), Green (RoHS & no Sb/Br); Manufacturer: Texas Instruments; I2C Address: 0100 xxx; 5V Tolerant I/O: Yes; fSCLK(Max)(MHz): 400; No. of Outputs: 8; VCC(Min)(V): 2.3; Technology Family: PCA; VCC(Max)(V): 5.5; SubFamily: I2C IO Expander; ComponentLink2URL: http://www.ti.com/litv/pdf/msoi003g; Vcc range(V): 2.3 to 5.5; Code_JEDEC: MS-013-AA; Mounting Technology: Surface Mount; ComponentLink1Description: Datasheet; Part Number: PCA9554DWR; PackageReference: DW0016A; # of I/Os: 8; PackageDescription: 16-Pin Small Outline Integrated Circuit, 10.3 x 7.5 mm, Pitch 1.27 mm Pitch; Interrupt Output: Yes; PackageVersion: revG, Jan-2011; Configuration Registers: Yes; Max Frequency(kHz): 400; Eco-Plan: Green (RoHS & no Sb/Br); ComponentLink2Description: Package Specification; DatasheetVersion: SCPS128B; Push-Pull I/O Type: Yes; ComponentLink1URL: http://www.ti.com/general/docs/lit/getliterature.tsp?genericPartNumber=PCA9554&fileType=pdf
U4 = CMP-2000-06185-1: Single-Channel 1-Wire Master, 2.9 to 5.5 V, -40 to 85 degC, 8-Pin SO, RoHS, Rail/Tube; Manufacturer: Maxim; Dynamic Catalog: I²CControllers; Product Training Modules: Lead(SnPb)FinishforCOTS / Long-TermSupplyProgram; Protocol: 1-Wire®; Interface: I²C; Function: Bridge,1-Wire®toI²C; Voltage - Supply: 3.3V,5V; Current - Supply: 750µA; Package Reference: SO-8; Category: IntegratedCircuits(ICs); Supplier Device Package: 8-SOIC; Packaging: Tube; Series: -; Manufacturer URL: http://www.maximintegrated.com/; Package URL: http://pdfserv.maximintegrated.com/package_dwgs/21-0041.PDF; Datasheet Version: Rev. 10, 01/2015; Standards: -; Mounting Technology: SurfaceMount; Package / Case: 8-SOIC(0.154",3.90mmWidth); Package Description: 8-Pin Small Outline Integrated Circuit, Body 5 x 4 mm, Pitch 1.27 mm; Family: Interface-Controllers; Standard Package: 100; Operating Temperature: -40°C~85°C; Datasheet URL: http://www.mouser.com/ds/2/256/DS2482-100-39831.pdf; Part Number: DS2482S-100+
U5 = MX614: Manufacturer: CML Microcircuits; Part Number: MX614TN
U6 = CMP-0115-02811-1: Flash Microcontroller with XLP Technology, 32 MHz, 15 I/O, -40 to 85 degC, 20-pin SSOP (SS20), Tube; Manufacturer: Microchip; Program Memory KWords: 8; RAM: 1024; Internal Oscillator: 32 MHz, 31 kHz; Max. CPU Speed MHz: 32; Timers: 4 - 8-bit, 1 - 16-bit; Operation Voltage Range: 1.8V - 3.6V; # of A/D Channels: 12; I/O Pins: 15; EEPROM Data Memory (bytes): 256; Program Memory KBytes: 14; Digital Communication: 1 -A/E/USART, 2 -MSSP(SPI/I2C); ComponentLink1URL: http://ww1.microchip.com/downloads/en/DeviceDoc/40001453D.pdf; ComponentLink2URL: http://www.microchip.com/stellent/groups/techpub_sg/documents/packagingspec/en012702.pdf; ComponentLink3URL: Product URL:http://www.microchip.com/datasheet/PIC16F1847; Mounting Technology: Surface Mount; ComponentLink3Description: URL Link1; PackageVersion: C04-072B, 12/2012; PackageReference: SSOP-SS20; DatasheetVersion: Rev. D; PackageDescription: 20-Lead Plastic Shrink Small Outline, 5.3 x 7.2 mm Body, 0.65 mm Pitch; ComponentLink1Description: Datasheet; Memory Type: Flash; Part Number: PIC16F1847-I/SS; Packing: TUBE; ComponentLink2Description: Package Specification
U7 = CMP-0187-00277-2: Rail-to-Rail Input/Output, 10 MHz Operational Amplifier, 8-Pin SOIC, Industrial Temperature; Manufacturer: Microchip; PackageDescription: 8-Lead Plastic Small Outline (SN) - Narrow, 3.90mm Body [SOIC]; ComponentLink2Description: Datasheet; RevisionNote: URLs added.; ComponentLink1URL: http://www.microchip.com/; ComponentLink3Description: Package Specification; ComponentLink3URL: http://www.microchip.com/stellent/groups/techpub_sg/documents/packagingspec/en012702.pdf; Code_JEDEC: MS-012; Code_IPC: SOIC127P600-8; ComponentLink1Description: Manufacturer URL; PackageVersion: revBB, Aug-2009; PackageReference: SOIC-SN8; DatasheetVersion: revD, Feb-2009; ComponentLink2URL: http://ww1.microchip.com/downloads/en/DeviceDoc/21685d.pdf; Part Number: MCP6023-I/SN
U8 = CMP-0163-00024-1: 64K, 8192x8-bit, 3.6V SPI Serial SRAM, 8-Pin TSSOP, Industrial Temperature; Manufacturer: Microchip; PackageReference: TSSOP-ST8; PackageDescription: 8-Lead Plastic Thin Shrink Small Outline (ST) - 4.4mm Body [TSSOP]; Code_JEDEC: MO-153; PackageVersion: revBB, Aug-2009; DatasheetVersion: revC, Apr-2009; Part Number: 23K640-I/ST
U9 = CMP-0788-00011-1: I2C(R) CMOS 8 x 8 Unbuffered Analog Switch Array with Dual / Single Supplies, +/-5 V Supply, 32-pin QFN (CP-32-2), Reel; Manufacturer: Analog Devices; Small Signal BW (MHz): 300; Output Buffer: No; ComponentLink1Description: Manufacturer URL; ComponentLink3URL: http://www.analog.com/static/imported-files/packages/414143737956480539664569CP_32_2.pdf; ComponentLink2Description: Datasheet; Part Number: ADG2188BCPZ-REEL7; Packing: Reel; ComponentLink1URL: http://www.analog.com/en/index.html; PackageVersion: Jan-05; PackageReference: CP-32-2; ComponentLink2URL: http://www.analog.com/static/imported-files/data_sheets/ADG2188.pdf; ComponentLink3Description: Package Specification; Code_JEDEC: MO-220-VHHD-2; Supply Voltage (V): +/-5; PackageDescription: 32-Pin Lead Frame Chip Scale Package, Body 5 x 5 mm, Pitch 0.5 mm; Mounting Technology: Surface Mount; Control Interface: I2C; DatasheetVersion: Rev. 0
UHFC VHFC = Header 9X2: Header, 9-Pin, Dual row; Part Number: 63453-118LF; Manufacturer: Amphenol; LatestRevisionDate: 17-Jul-2002; LatestRevisionNote: Re-released for DXP Platform.; Publisher: Altium Limited
USB1 = CMP-2000-07498-1: USB-B Receptacle Connector, Height 10.87 mm, 0 to 50 degC, RoHS, Tray; Manufacturer: TE Connectivity; Part Number: 1-1734346-1; Insulation Resistance: 1GR; Number of Contacts: 4; Number of Ports: 1; Plating: Nickel; Case\/Package: SMD/SMT; Insulation Material: Thermoplastic; Gender: Receptacle; Depth: 16mm; Contact Material: Bronze; Length: 16.5mm; ELV: Compliant; Packaging: Tray; RoHSCompliant: true; Number of Terminals: 4; Manufacturer URL: http://www.te.com/; Datasheet Version: Rev. C, 06/2011; Package Reference: 1734346-1; Flammability Rating: UL94V-0; Package Description: 4-Pin Pin Surface Mount Device, Body 12.04 x 16 mm, Height 10.87 mm; Mount: Horizontal; Mounting Technology: SurfaceMount; REACH SVHC: Unknown; Material: Bronze; Housing Colour: Black; Contact Plating: Gold; Package Quantity: 100; Orientation: RightAngle; Termination: SMD/SMT; Housing Material: Nylon; Number of Positions: 4; Datasheet URL: http://www.te.com/commerce/DocumentDelivery/DDEController?Action=srchrtrv&DocNm=1734346&DocType=Customer+Drawing&DocLang=English; Connector Type: Receptacle
Y1 = CMP-1688-00002-1: Ceramic SMD Crystal, 8 MHz, +/- 20 ppm, 200 Ohm, -20 to 70 degC, 4-Pin SMD, RoHS, Tape and Reel; Manufacturer: Abracon; Max Supply Voltage: 45 V; Outputs: 4; Min Supply Voltage: 8.2 V; Output Voltage: 3.3 V; Switching Frequency: 30 KHz; Output Current: 1.8 A; Packaging: Rail/Tube; ComponentLink2Description: Datasheet; REACH SVHC: No SVHC; ComponentLink1URL: http://www.abracon.com/; PackageReference: ABM3B; Weight: 0.004233 oz; Height: 1.05 mm; ComponentLink2URL: http://www.abracon.com/Resonators/abm3b.pdf; Mount: Surface Mount; Min Operating Temperature: -40 degC; Max Operating Temperature: 85 degC; Package Quantity: 50; PackageDescription: 4-Pin Surface Mount Device, Body 5 x 3.2 mm; Pins: 28; DatasheetVersion: Aug-15; ComponentLink1Description: Manufacturer URL; RoHSCompliant: true; Radiation Hardening: No; Length: 9.8 mm; Width: 4.5 mm; Part Number: ABM3B-20.000MHZ-B2-T
Y2 = CMP-1669-00002-2: CRYSTAL 8.00 MHZ 20PF 49US; Manufacturer: ECS; ComponentLink1URL: http://www.ecsxtal.com/store/pdf/hc-49usx.pdf; Part Number: ECS-035-18-4X-DU; ComponentLink1Description: Datasheet; PackageReference: 4X-3IL